# EasyEDA schematic SCH_miliohn_2026-04-19.json
TITLE: Diseño PCB; REV: 1.0; Date: 2026-02-22; Sheet: 1/1; Drawn By: richararaque09; Company: Your Company
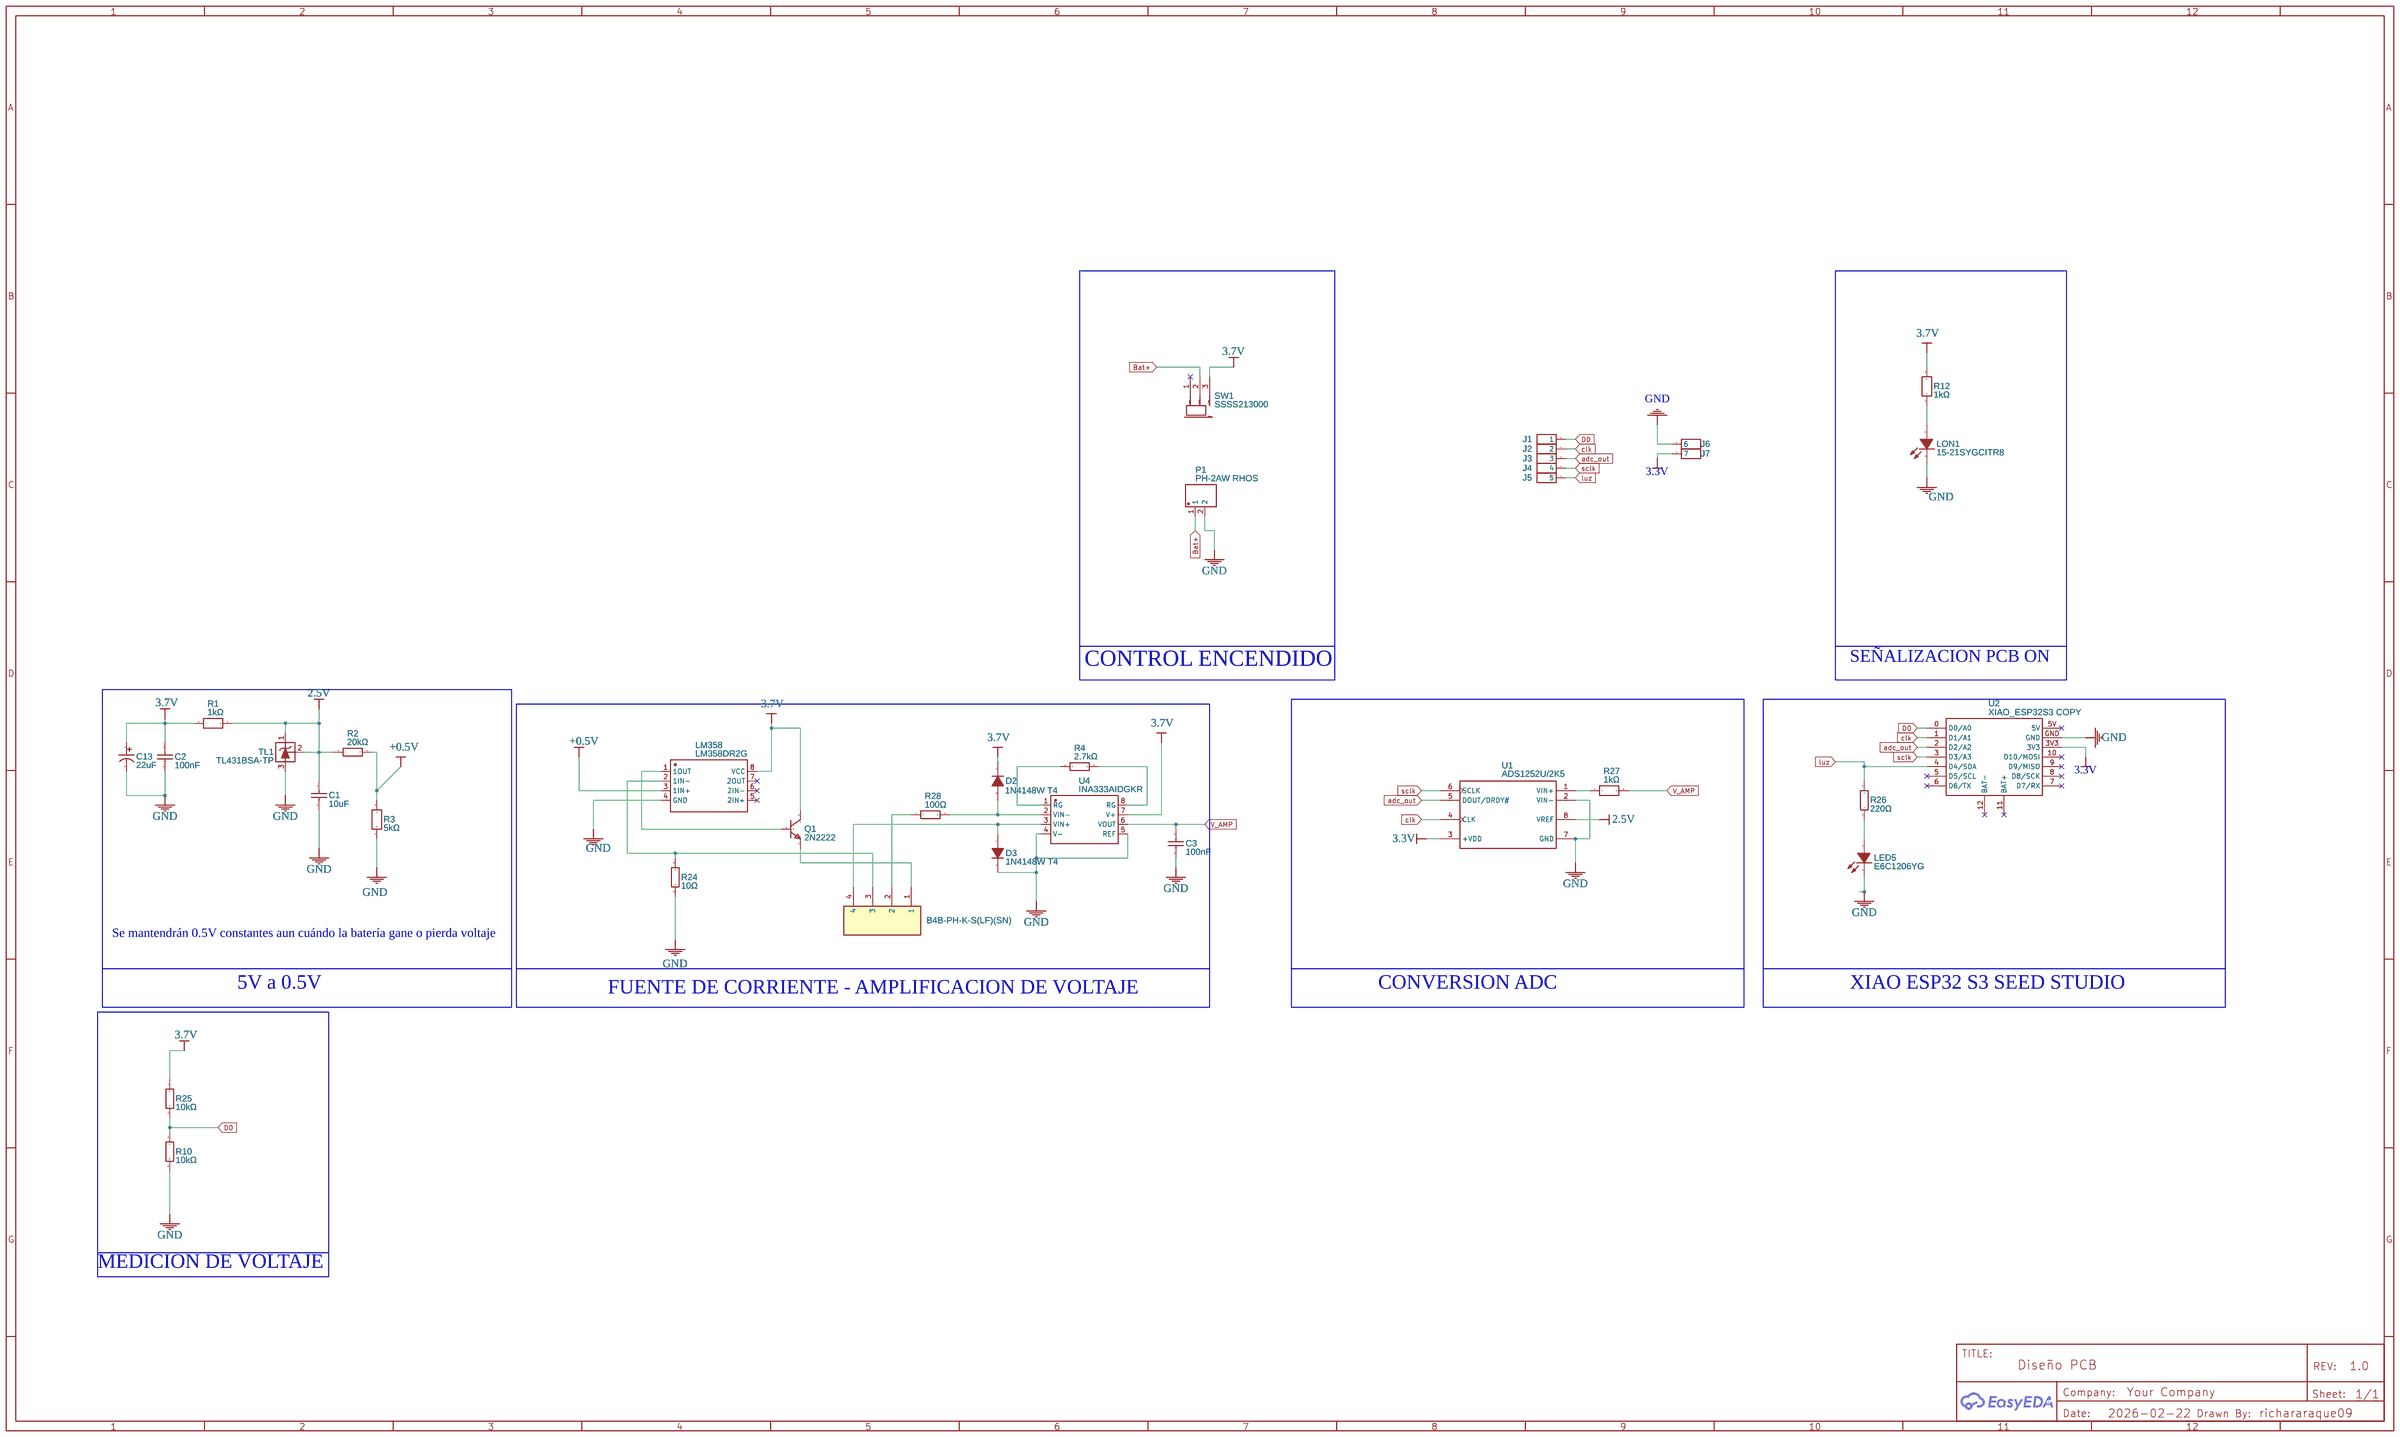
[diagram p0: schematic sheet]

## Parts
C1  10uF  [C1206]
C2  100nF  [C1206]
C3  100nF  [C1206]
C13  22uF  [CAP-SMD_BD4.0-L4.3-W4.3-FD-LS5.3]
D2  1N4148W T4  [SOD-123_L2.8-W1.8-LS3.7-RD]
D3  1N4148W T4  [SOD-123_L2.8-W1.8-LS3.7-RD]
J1  HDR-M-2.54_1x1  [HDR-M-2.54_1X1]
J2  HDR-M-2.54_1x1  [HDR-M-2.54_1X1]
J3  HDR-M-2.54_1x1  [HDR-M-2.54_1X1]
J4  HDR-M-2.54_1x1  [HDR-M-2.54_1X1]
J5  HDR-M-2.54_1x1  [HDR-M-2.54_1X1]
J6  HDR-M-2.54_1x1  [HDR-M-2.54_1X1]
J7  HDR-M-2.54_1x1  [HDR-M-2.54_1X1]
LED5  E6C1206YG  [LED-SMD_L3.2-W1.6_E6C1206YG]
LM358  LM358DR2G  [SOIC-8_L5.0-W4.0-P1.27-LS6.0-BL]
LON1  15-21SYGCITR8  [LED1206-RD_YELLOW-1]
P1  PH-2AW RHOS  [CONN-TH_2P-P2.00_PH-2AW]
Q1  2N2222  [TO-92-3_L4.9-W3.7-P1.27-L]
R1  1kΩ  [R1206]
R2  20kΩ  [R1206]
R3  5kΩ  [R1206]
R4  2.7kΩ  [R1206]
R10  10kΩ  [R1206]
R12  1kΩ  [R1206]
R24  10Ω  [R1206]
R25  10kΩ  [R1206]
R26  220Ω  [R1206]
R27  1kΩ  [R1206]
R28  100Ω  [R0805]
SW1  SSSS213000  [SW-TH_SSSS213000]
TEST1  B4B-PH-K-S(LF)(SN)  [CONN-TH_B4B-PH-K-S]
TL1  TL431BSA-TP  [SOT-23-3_L2.9-W1.3-P1.90-LS2.4-BR]
U1  ADS1252U/2K5  [SOIC-8_L4.9-W3.9-P1.27-LS6.0-BL]
U2  XIAO_ESP32S3 COPY  [XIAO-ESP32-S3]
U4  INA333AIDGKR  [MSOP-8_L3.0-W3.0-P0.65-LS5.0-BL]

## Library data of the parts
C1 = CL31A106KBHNNNE: Supplier: LCSC; Manufacturer: SAMSUNG(三星); Supplier Part: C13585; JLCPCB Part Class: Basic Part
C2 C3 = CL31B104KBCNNNC: Supplier: LCSC; Manufacturer: SAMSUNG(三星); Supplier Part: C24497; JLCPCB Part Class: Basic Part
C13 = RVT1C220M0405_C3356: Supplier: LCSC; Manufacturer: HONOR(荣誉); Manufacturer Part: RVT1C220M0405; Supplier Part: C3356; JLCPCB Part Class: Extended Part
D2 D3 = 1N4148W T4: Contributor: 立创EDA官方封装库; Supplier: LCSC; Manufacturer: CJ(江苏长电/长晶); Manufacturer Part: 1N4148W; Supplier Part: C2099; JLCPCB Part Class: Extended Part
J1-J7 = HDR-M-2.54_1x1: Supplier Part: C81276; Supplier: LCSC; Contributor: LCEDA_Lib
LED5 = E6C1206YG: Supplier: LCSC; Manufacturer: KENTO; Manufacturer Part: KT-1206YG; Supplier Part: C15595; JLCPCB Part Class: Extended Part
LM358 = LM358DR2G: Supplier: LCSC; Manufacturer: onsemi(安森美); Supplier Part: C7950; JLCPCB Part Class: Basic Part
LON1 = 15-21SYGCITR8: Supplier: LCSC; Manufacturer: KENTO; Manufacturer Part: KT-1206Y; Supplier Part: C2298; JLCPCB Part Class: Extended Part
P1 = PH-2AW RHOS: Supplier: LCSC; Manufacturer: BOOMELE(博穆精密); Manufacturer Part: PH-2AW; Supplier Part: C16965; JLCPCB Part Class: Extended Part
Q1 = 2N2222: Contributor: LCSC; Supplier: LCSC; Manufacturer: ST(先科); Manufacturer Part: 2N2222A; Supplier Part: C118536; JLCPCB Part Class: Extended Part
R1 R12 R27 = SCR1206J1K: Contributor: lcsc; Supplier: LCSC; Supplier Part: C3018015; Manufacturer: VO(翔胜); JLCPCB Part Class: Extended Part
R2 = 1206W4F2002T5E: Supplier: LCSC; Manufacturer: UNI-ROYAL(厚声); Supplier Part: C18003; JLCPCB Part Class: Extended Part
R3 = RT1206BRD075KL: Supplier: LCSC; Supplier Part: C870818; Manufacturer: YAGEO(国巨); Contributor: lcsc; JLCPCB Part Class: Extended Part
R4 = 1206W4F2701T5E: Supplier: LCSC; Manufacturer: UNI-ROYAL(厚声); Supplier Part: C17950; JLCPCB Part Class: Extended Part
R10 R25 = 1206W4F1002T5E: Supplier: LCSC; Manufacturer: UNI-ROYAL(厚声); Supplier Part: C17902; JLCPCB Part Class: Basic Part
R24 = SG732BTTD100K: Contributor: LCSC; Supplier: LCSC; Manufacturer: KOA; Supplier Part: C160103; JLCPCB Part Class: Extended Part
R26 = 1206W4F2200T5E: Supplier: LCSC; Manufacturer: UNI-ROYAL(厚声); Supplier Part: C17957; JLCPCB Part Class: Extended Part
R28 = 0805W8F1000T5E: Supplier: LCSC; Manufacturer: UNI-ROYAL(厚声); Supplier Part: C17408; JLCPCB Part Class: Basic Part
SW1 = SSSS213000: Contributor: LCSC; Supplier: LCSC; Manufacturer: ALPSALPINE(阿尔卑斯阿尔派); Supplier Part: C125054; JLCPCB Part Class: Extended Part
TEST1 = B4B-PH-K-S(LF)(SN): Contributor: LCSC; Supplier: LCSC; Manufacturer: JST; Supplier Part: C131334; JLCPCB Part Class: Extended Part
TL1 = TL431BSA-TP: Supplier: LCSC; Supplier Part: C48586693; Manufacturer: TECH PUBLIC(台舟); Contributor: lcsc; JLCPCB Part Class: Extended Part
U1 = ADS1252U/2K5: Contributor: LCSC; Supplier: LCSC; Supplier Part: C70912; Manufacturer: TI(德州仪器); JLCPCB Part Class: Extended Part
U2 = XIAO_ESP32S3 COPY: Manufacturer: SeeedStudio; Manufacturer Part: XIAO ESP32S3; Supplier Part: 1597-113991054-ND; Supplier: Digi-Key; link: https://www.seeedstudio.com/XIAO-ESP32S3-p-5627.html; Contributor: customyota
U4 = INA333AIDGKR: Supplier: LCSC; Manufacturer: TI(德州仪器); Supplier Part: C19450; JLCPCB Part Class: Extended Part

## Nets
2.5V: C1.1 R1.2 R2.2 TL1.1(K) TL1.2(REF) U1.8(VREF)
3.3V: J7.1(7) U1.3(+VDD) U2.3V3
3.7V: C2.1 C13.1 D2.1(K) LM358.8(VCC) Q1.3(C) R1.1 R12.2 R25.1 SW1.3 U4.7(V+)
+0.5V: LM358.3(1IN+) R2.1 R3.2
GND: C1.2 C2.2 C3.2 C13.2 D3.1(K) J6.1(6) LED5.2(-) LM358.4(GND) LON1.1(-) P1.2 R3.1 R10.2 R24.1 TL1.3(A) U1.2(VIN-) U1.7(GND) U2.GND U4.4(V-) U4.5(REF)
adc_out: J3.1(3) U1.5(DOUT/DRDY#) U2.2(D2/A2)
Bat+: P1.1 SW1.2
clk: J2.1(2) U1.4(CLK) U2.1(D1/A1)
D0: J1.1 R10.1 R25.2 U2.0(D0/A0)
luz: J5.1(5) R26.2 U2.4(D4/SDA)
sclk: J4.1(4) U1.6(SCLK) U2.3(D3/A3)
V_AMP: C3.1 R27.2 U4.6(VOUT)
Net-(D2-2): D2.2(A) R28.2 U4.2(VIN-)
Net-(D3-2): D3.2(A) TEST1.4 U4.3(VIN+)
Net-(LED5-1): LED5.1(+) R26.1
Net-(LM358-1): LM358.1(1OUT) Q1.2(B)
Net-(LM358-2): LM358.2(1IN-) R24.2 TEST1.3
Net-(LON1-2): LON1.2(+) R12.1
Net-(Q1-1): Q1.1(E) TEST1.1
Net-(R4-1): R4.1 U4.1(RG)
Net-(R4-2): R4.2 U4.8(RG)
Net-(R27-1): R27.1 U1.1(VIN+)
Net-(R28-1): R28.1 TEST1.2

Not connected (* = marked no-connect by the designer): LM358 5(2IN+)* 6(2IN-)* 7(2OUT)*; SW1 1*; U2 5(D5/SCL)* 5V* 6(D6/TX)* 7(D7/RX)* 8(D8/SCK)* 9(D9/MISO)* 10(D10/MOSI)* 11(BAT+)* 12(BAT-)*

## Notes on the sheet
- CONTROL ENCENDIDO
- SEÑALIZACION PCB ON
- Se mantendrán 0.5V constantes aun cuándo la batería gane o pierda voltaje
- 5V a 0.5V
- CONVERSION ADC
- XIAO ESP32 S3 SEED STUDIO
- FUENTE DE CORRIENTE - AMPLIFICACION DE VOLTAJE
- MEDICION DE VOLTAJE
